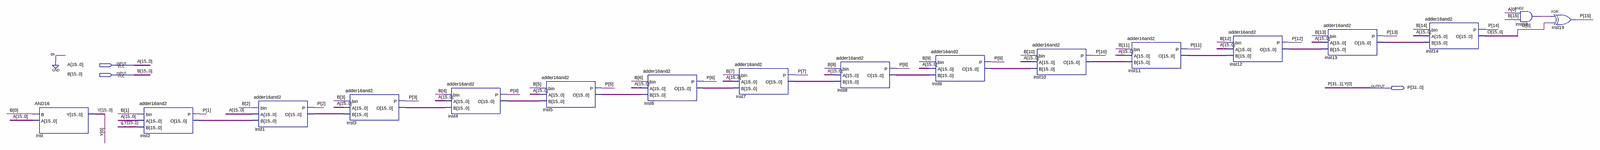
[diagram p0: schematic sheet, whole]
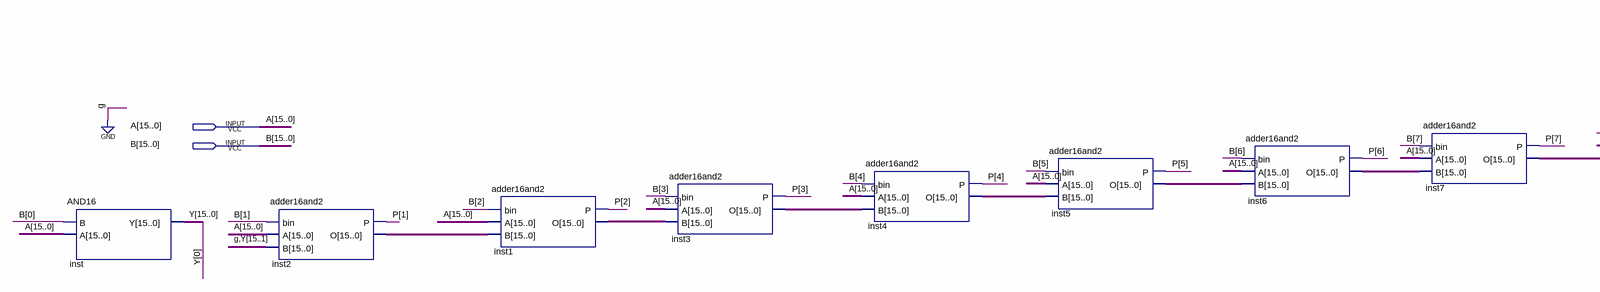
[diagram p1: schematic sheet, left part]
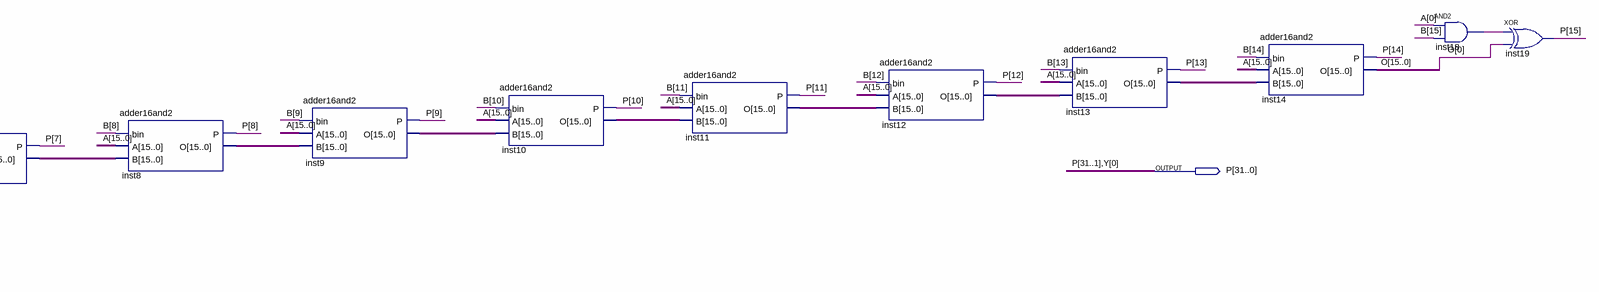
[diagram p2: schematic sheet, right part]
// Quartus schematic multiplier.bdf as structural Verilog: 17 symbols, 3 pins
module multiplier (
  input  [15:0] A,
  input  [15:0] B,
  output [31:0] P
);

  wire inst18_out;
  wire [15:0] inst1_o, inst2_o, inst3_o, inst4_o, inst5_o, inst6_o, inst7_o, inst8_o, inst9_o, inst10_o,
       inst11_o, inst12_o, inst13_o, O;
  wire [15:1] Y;

  AND16 inst (.B(B[0]), .A(A), .Y({Y, P[0]}));
  adder16and2 inst2 (.bin(B[1]), .A(A), .B({1'b0, Y}), .P(P[1]), .O(inst2_o));
  adder16and2 inst1 (.bin(B[2]), .A(A), .B(inst2_o), .P(P[2]), .O(inst1_o));
  adder16and2 inst3 (.bin(B[3]), .A(A), .B(inst1_o), .P(P[3]), .O(inst3_o));
  adder16and2 inst4 (.bin(B[4]), .A(A), .B(inst3_o), .P(P[4]), .O(inst4_o));
  adder16and2 inst5 (.bin(B[5]), .A(A), .B(inst4_o), .P(P[5]), .O(inst5_o));
  adder16and2 inst6 (.bin(B[6]), .A(A), .B(inst5_o), .P(P[6]), .O(inst6_o));
  adder16and2 inst7 (.bin(B[7]), .A(A), .B(inst6_o), .P(P[7]), .O(inst7_o));
  adder16and2 inst8 (.bin(B[8]), .A(A), .B(inst7_o), .P(P[8]), .O(inst8_o));
  adder16and2 inst9 (.bin(B[9]), .A(A), .B(inst8_o), .P(P[9]), .O(inst9_o));
  adder16and2 inst10 (.bin(B[10]), .A(A), .B(inst9_o), .P(P[10]), .O(inst10_o));
  adder16and2 inst11 (.bin(B[11]), .A(A), .B(inst10_o), .P(P[11]), .O(inst11_o));
  adder16and2 inst12 (.bin(B[12]), .A(A), .B(inst11_o), .P(P[12]), .O(inst12_o));
  adder16and2 inst13 (.bin(B[13]), .A(A), .B(inst12_o), .P(P[13]), .O(inst13_o));
  adder16and2 inst14 (.bin(B[14]), .A(A), .B(inst13_o), .P(P[14]), .O(O));
  and inst18 (inst18_out, A[0], B[15]);
  xor inst19 (P[15], inst18_out, O[0]);

  // Other names for the same wires on the sheet: Y[0] = P[0]
endmodule
